# EAGLE design power1pDIN5 (EAGLE 9.3.1)
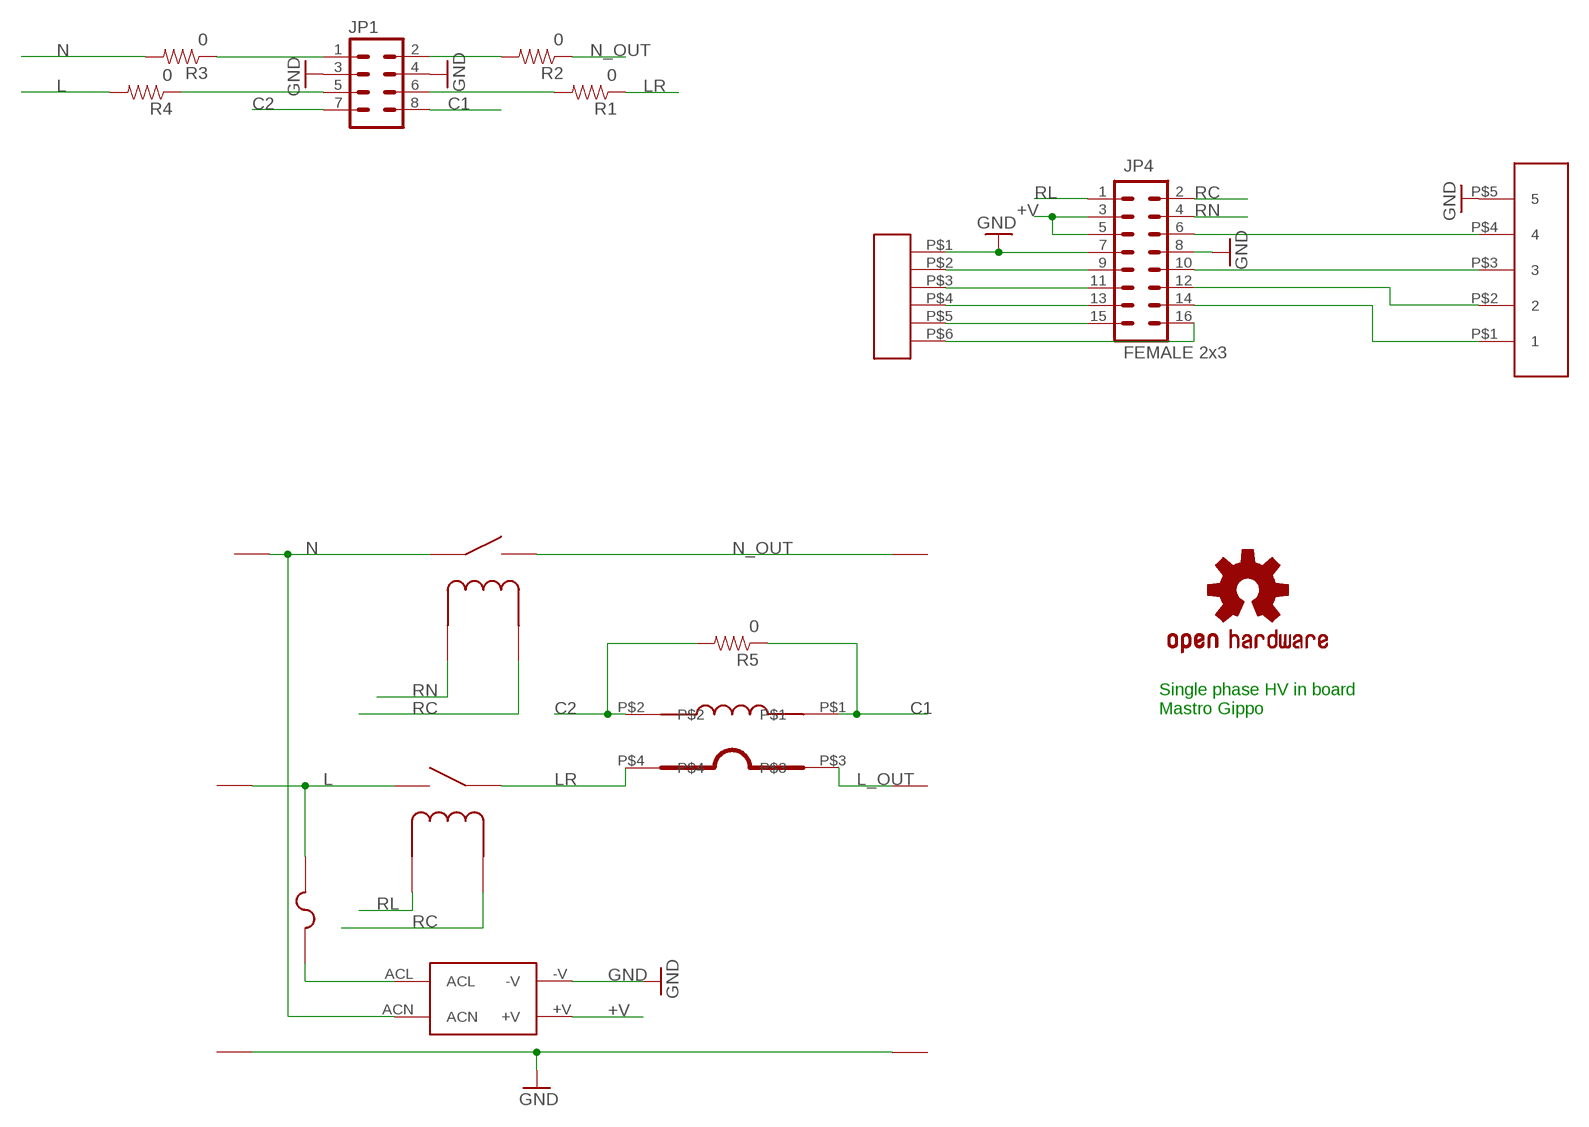
[diagram p0: schematic, sheet 1]

## Parts
JP1  M04X2  [2X4]
JP4  FEMALE 2x3  M08X2  [2X8]
R1  0  RESISTOR0805-RES  [0805]
R2  0  RESISTOR0805-RES  [0805]
R3  0  RESISTOR0805-RES  [0805]
R4  0  RESISTOR0805-RES  [0805]
R5  0  RESISTOR0805-RES  [0805]
U$1  T9S  [T9SSOLAR]
U$2  T9S  [T9SSOLAR]
U$3  PLH5_1  [PLH5]
U$4  PLH5_1  [PLH5]
U$5  PLH5_1  [PLH5]
U$6  PLH5_1  [PLH5]
U$7  FUSE-0ZRE0008FF1C  [0ZRE0008FF1C]
U$8  CSE187L  [CSE187L]
U$9  PLH5_1  [PLH5]
U$10  PLH5_1  [PLH5]
U$11  PTSA5  [PTSA5]
U$12  IRM-10-12  [ACDCMEANWELL]
U$13  OSHW-LOGOM  [OSHW-LOGO-M]
U$14  PTSA6  [PTSA6]

## Nets
+V: JP4.3 JP4.5 U$12.+V
C1: JP1.8 R5.1 U$8.P$1
C2: JP1.7 R5.2 U$8.P$2
GND: JP1.3 JP1.4 JP4.7 JP4.8 U$9.P$1 U$9.P$2 U$10.P$1 U$10.P$2 U$11.P$5 U$12.-V U$14.P$1
L: R4.2 U$2.TL1(TL) U$2.TL2(TL) U$4.P$1 U$4.P$2 U$7.P$2
L_OUT: U$6.P$1 U$6.P$2 U$8.P$3
LR: R1.1 U$2.TR1(TR) U$2.TR2(TR) U$8.P$4
N: R3.2 U$1.TR1(TR) U$1.TR2(TR) U$3.P$1 U$3.P$2 U$12.ACN
N$1: JP1.2 R2.2
N$2: JP4.15 U$14.P$5
N$3: JP4.13 U$14.P$4
N$4: JP4.11 U$14.P$3
N$5: JP1.6 R1.2
N$6: JP1.1 R3.1
N$7: JP4.9 U$14.P$2
N$8: JP4.16 U$14.P$6
N$9: JP1.5 R4.1
N$10: JP4.6 U$11.P$4
N$11: JP4.10 U$11.P$3
N$12: JP4.12 U$11.P$2
N$13: U$7.P$1 U$12.ACL
N$14: JP4.14 U$11.P$1
N_OUT: R2.1 U$1.TL1(TL) U$1.TL2(TL) U$5.P$1 U$5.P$2
RC: JP4.2 U$1.C1 U$2.C2
RL: JP4.1 U$2.C1
RN: JP4.4 U$1.C2

## Notes on the sheet
- Single phase HV in board
  Mastro Gippo

## Library data of the parts
JP1 = SparkFun-Connectors:M04X2: .1" header, two rows of four.
JP4 = SparkFun-Connectors:M08X2: .1" headers, two rows of 8 each
R1-R5 = SparkFun-Resistors:RESISTOR: Resistor Basic schematic elements and footprints for 0603, 1206, and PTH resistors.
U$1 U$2 = evse:T9S
U$3-U$6 U$9 U$10 = evse:PLH5_1
U$7 = evse:FUSE-0ZRE0008FF1C
U$8 = evse:CSE187L
U$11 = evse:PTSA5
U$12 = evse:IRM-10-12
U$13 = mastrogippo:OSHW-LOGO: Open Source Hardware Logo This logo indicates the piece of hardware it is found on incorporates a OSHW license and/or adheres to the definition of open source hardware found here: http://freedomdefined.org/OSHW
U$14 = evse:PTSA6

## Board
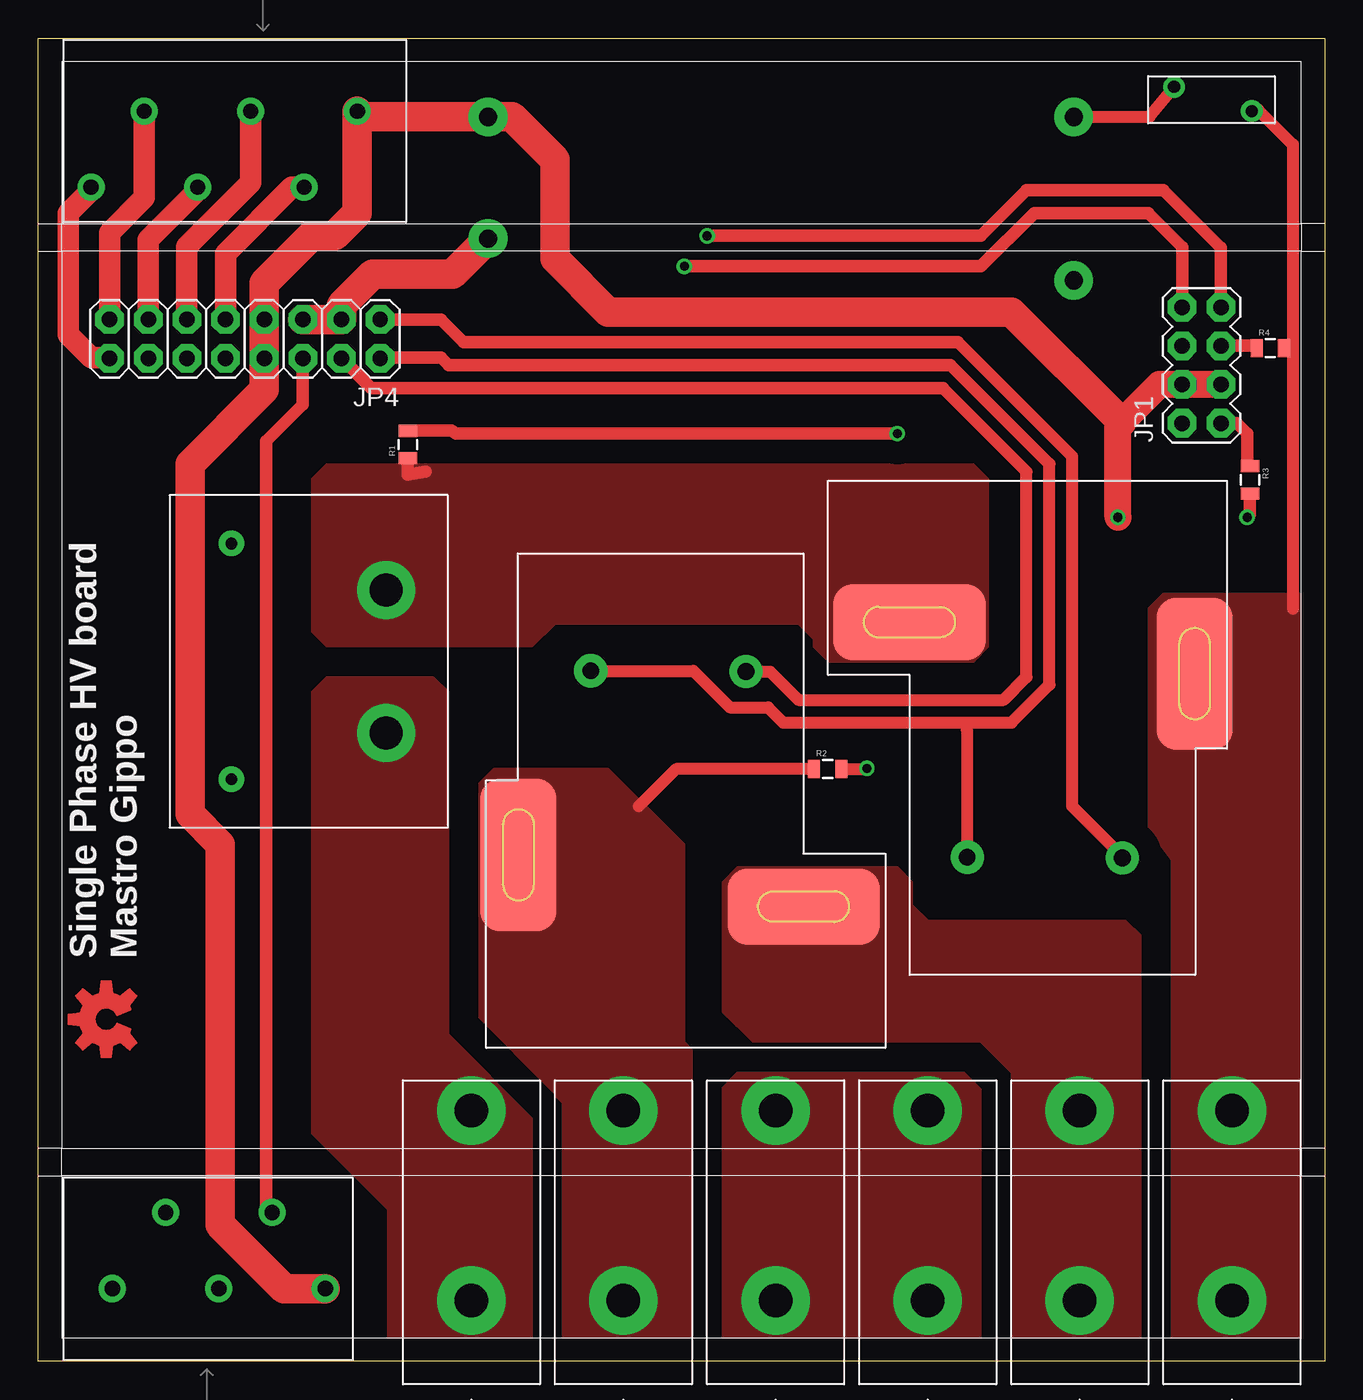
[diagram p1: board, top side]
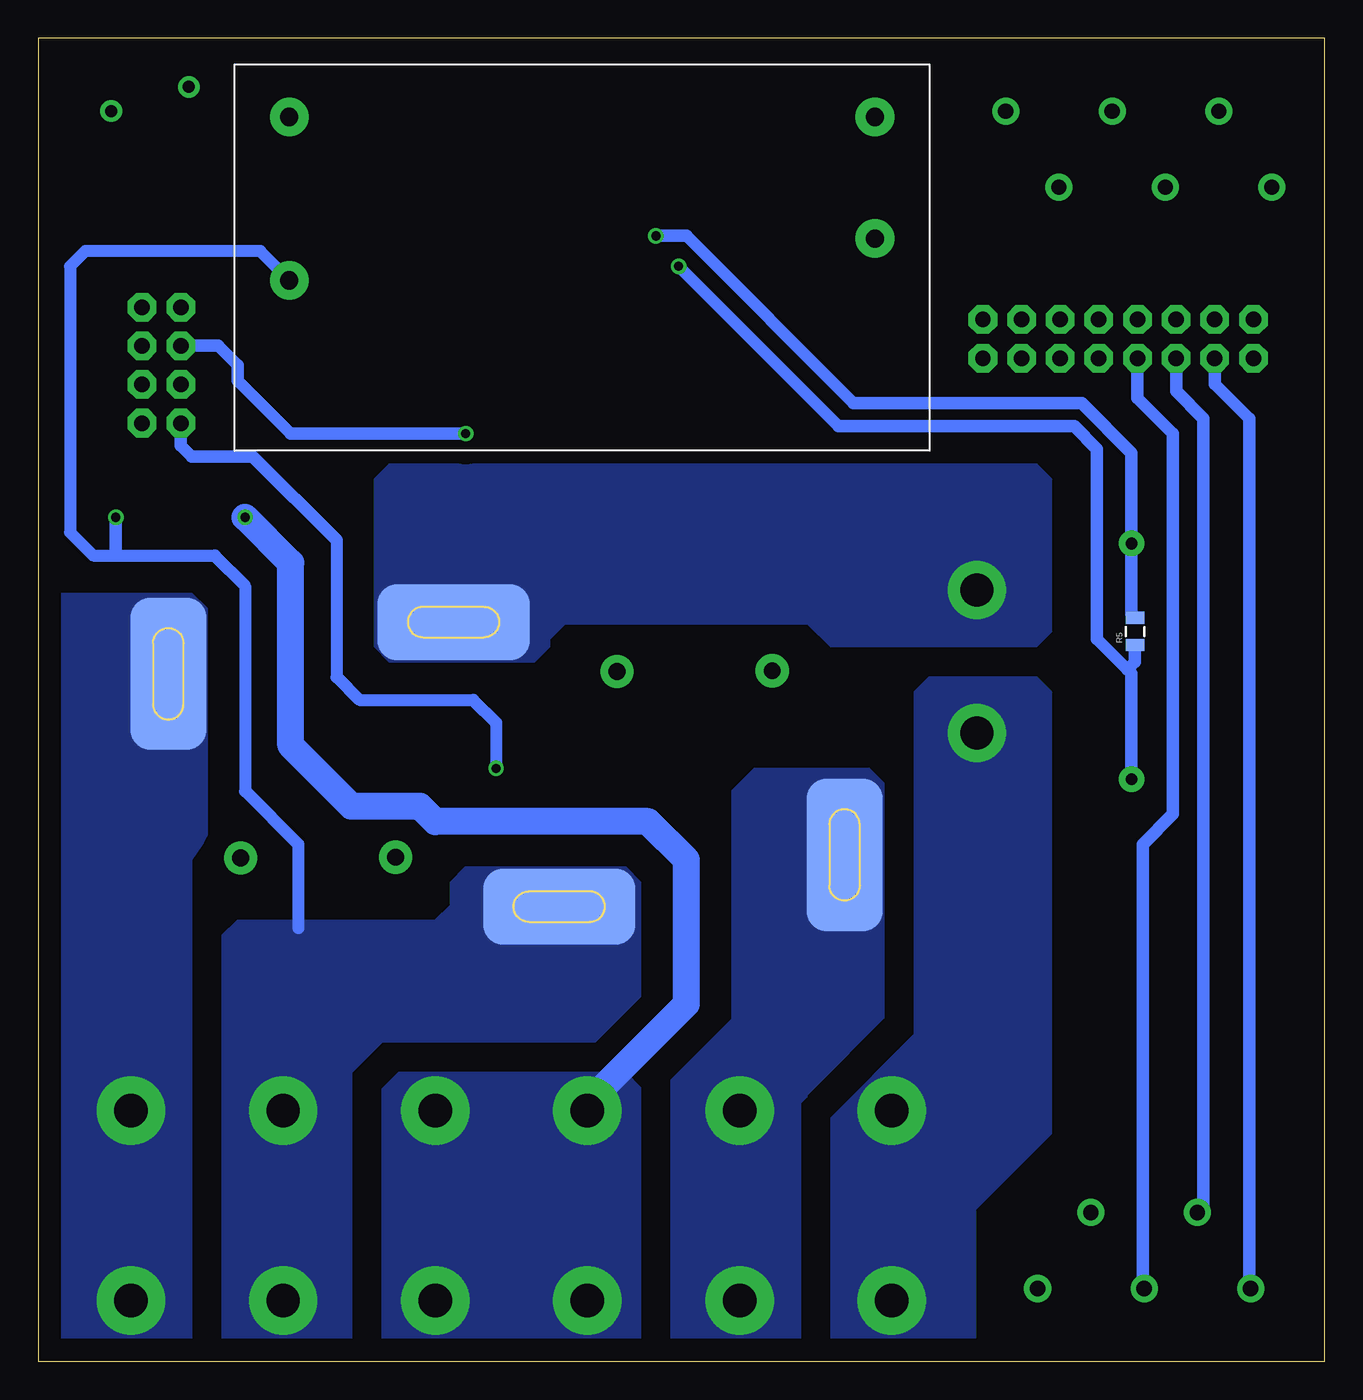
[diagram p2: board, bottom side, seen from below]

Size 84.6 x 87 mm. Coordinates in mm from the lower left corner, seen from the top.
Outline: 84.6,87 84.6,0 0,0 0,87 84.6,87
Copper layers (1*16): Top 0.035mm / dielectric 1.5mm / Bottom 0.035mm
Design rules "default": minimum track width 10mil, minimum drill 24mil, track to track 8mil, track to pad 8mil, pad to pad 8mil, via to via 8mil, smd to smd 8mil, copper to edge 40mil, drill to drill 8mil, minimum pad ring 10mil, minimum via ring 8mil, stop-mask expansion 4mil, vias tented up to drill 0mil, thermal gap 10mil

### Footprints (pad centres in the part's own frame; a part is rotated, then mirrored left to right if it is on the bottom)
2X4 = drill 1.016 pad 1.88 octagon: 1 -3.81,-1.27; 2 -3.81,1.27; 3 -1.27,-1.27; 4 -1.27,1.27; 5 1.27,-1.27; 6 1.27,1.27; 7 3.81,-1.27; 8 3.81,1.27
2X8 = drill 1.016 pad 1.88 octagon: 1 0,0; 2 0,2.54; 3 2.54,0; 4 2.54,2.54; 5 5.08,0; 6 5.08,2.54; 7 7.62,0; 8 7.62,2.54; 9 10.16,0; 10 10.16,2.54; 11 12.7,0; 12 12.7,2.54; 13 15.24,0; 14 15.24,2.54; 15 17.78,0; 16 17.78,2.54
0805 = smd 0.8 x 1.2: 1 -0.9,0; 2 0.9,0
T9SSOLAR = drill 1.1 pad 2.184: C1 -14,-15.5; C2 -3.8,-15.45 | smd 5 x 10: TL1 -18.75,-3.4 | smd 5 x 10 bottom: TL2 -18.75,-3.4 | smd 10 x 5: TR1 0,0 | smd 10 x 5 bottom: TR2 0,0
PLH5 = drill 2.2 pad 4.5: P$1 0,0; P$2 0,12.5
0ZRE0008FF1C = drill 0.8 pad 1.422: P$1 1.7,-0.7; P$2 6.8,-2.3
CSE187L = drill 0.762 pad 1.676: P$1 -7.747,5.08; P$2 7.747,5.08 | drill 2.159 pad 3.81: P$3 -4.699,-5.08; P$4 4.699,-5.08
PTSA5 = drill 1 pad 1.778: P$1 0,0; P$2 3.5,5; P$3 7,0; P$4 10.5,5; P$5 14,0
ACDCMEANWELL = drill 1.2 pad 2.54: +V 3.6,-11.5; -V 3.6,-3.5; ACL 42.1,-3.5; ACN 42.1,-14.25
PTSA6 = drill 1 pad 1.778: P$1 0,0; P$2 3.5,5; P$3 7,0; P$4 10.5,5; P$5 14,0; P$6 17.5,5

### Placement (x,y rotation side)
JP1  76.49,65.49 90 top
JP4  22.49,68.49 180 top
R1  24.31,60.28 90 top
R2  51.91,38.95 0 top
R3  79.67,57.96 270 top
R4  81.01,66.61 0 top
R5  12.49,47.99 90 bottom
U$1  50.33,29.9 180 bottom
U$2  57.29,48.61 0 bottom
U$3  68.49,3.99 0 top
U$4  78.49,3.99 0 top
U$5  38.49,3.99 0 top
U$6  28.49,3.99 0 top
U$7  72.99,84.49 0 top
U$8  17.8,46.02 90 top
U$9  48.49,3.99 0 top
U$10  58.49,3.99 0 top
U$11  4.89,4.79 0 top
U$12  25.99,85.32 0 top
U$13  4.49,22.49 90 top
U$14  20.99,82.19 180 top

### Tracks (layer width: path | path; a pad name or v marks a point on that pad's centre or on a via)
+V
  Top 1.93: JP4.5 JP4.3 19.95,69.45 21.99,71.49 27.26,71.49 U$12.+V
C1  (via drill 0.6)
  Top 0.813: v42.49,71.99 61.99,71.99 65.49,75.49 72.99,75.49 75.22,73.26 JP1.8
  Bottom 0.813: U$8.P$1 12.72,45.22 12.99,45.49 | 12.99,45.49 14.99,47.49 14.99,59.99 16.49,61.49 31.99,61.49 v42.49,71.99 | R5.1 12.49,45.99 12.99,45.49
C2  (via drill 0.6)
  Top 0.813: v43.99,73.99 61.99,73.99 64.99,76.99 73.99,76.99 77.76,73.22 JP1.7
  Bottom 0.813: v43.99,73.99 41.99,73.99 30.99,62.99 15.99,62.99 12.72,59.72 U$8.P$2 12.72,49.12 R5.2
GND  (via drill 0.6)
  Top 1.778: v70.99,55.49 70.99,61.49 71.24,61.74 73.72,64.22 JP1.4 JP1.3
  Top 1.93: 71.24,61.74 63.99,68.99 37.49,68.99 33.99,72.49 33.99,78.99 31.16,81.82 U$12.-V 21.36,81.82 U$14.P$1 20.99,75.49 19.49,73.99 17.99,73.99 14.87,70.87 JP4.7 JP4.8 14.87,63.87 9.99,58.99 9.99,35.99 11.99,33.99 11.99,8.99 16.19,4.79 U$11.P$5
  Bottom 1.778: U$9.P$2 47.99,17.49 41.99,23.49 41.99,32.99 44.49,35.49 58.49,35.49 59.49,36.49 63.99,36.49 67.99,40.49 67.99,52.49 v70.99,55.49
  pour Top (isolate 1.5, rank 6, no thermals): 44.99,2.49 44.99,1.49 44.99,0.99 45.49,0.49 45.99,-0.01 60.99,-0.01 61.99,0.99 61.99,17.99 60.99,18.99 45.99,18.99 44.99,17.99
  pour Bottom (isolate 1.5, rank 6, no thermals): 44.99,2.49 44.99,1.49 44.99,0.99 45.49,0.49 45.99,-0.01 60.99,-0.01 61.99,0.99 61.99,17.99 60.99,18.99 45.99,18.99 44.99,17.99
L
  Top 0.8: 82.49,49.49 82.49,66.49 82.49,79.99 80.19,82.29 U$7.P$2
  Top 0.813: R4.2 82.37,66.61 82.49,66.49
  pour Top (isolate 1.5, rank 4, no thermals): 74.49,0.99 75.49,-0.01 81.99,-0.01 84.49,2.49 84.49,49.49 83.49,50.49 73.99,50.49 72.99,49.49 72.99,34.99 74.49,32.99
  pour Bottom (isolate 1.5, rank 4, no thermals): 74.49,0.99 75.49,-0.01 81.99,-0.01 84.49,2.49 84.49,49.49 83.49,50.49 74.49,50.49 73.49,49.49 73.49,34.49 74.49,32.99
L_OUT
  pour Top (isolate 1.5, no thermals): 32.49,0.99 31.49,-0.01 23.99,-0.01 22.99,0.99 22.99,9.99 17.99,14.99 17.99,43.99 18.99,44.99 25.99,44.99 26.99,43.99 26.99,21.49 32.49,15.99
  pour Bottom (isolate 1.5, no thermals): 32.49,0.99 31.49,-0.01 23.99,-0.01 22.99,0.99 22.99,9.99 17.99,14.99 17.99,43.99 18.99,44.99 25.99,44.99 26.99,43.99 26.99,21.49 32.49,15.99
LR
  Top 0.813: R1.1 24.31,58.31 25.49,58.49
  pour Top (isolate 1.5, rank 5, no thermals): 50.99,47.49 50.99,46.99 51.99,45.99 61.49,45.99 62.49,46.99 62.49,57.99 61.49,58.99 18.99,58.99 17.99,57.99 17.99,47.99 18.99,46.99 32.49,46.99 33.99,48.49 49.99,48.49
  pour Bottom (isolate 1.5, rank 5, no thermals): 50.99,47.49 50.99,46.99 51.99,45.99 61.49,45.99 62.49,46.99 62.49,57.99 61.49,58.99 18.99,58.99 17.99,57.99 17.99,47.99 18.99,46.99 32.49,46.99 33.99,48.49 49.99,48.49
N  (via drill 0.6)
  Top 0.813: R3.2 79.67,55.68 v79.49,55.49
  Bottom 0.8: U$12.ACN 68.09,71.09 69.99,72.99 81.49,72.99 82.49,71.99 82.49,54.49 80.99,52.99 79.49,52.99 72.99,52.99 70.99,50.99 70.99,37.49 67.49,33.99 67.49,28.49
  Bottom 0.813: v79.49,55.49 79.49,52.99
  pour Top (isolate 1.5, rank 3, no thermals): 72.49,0.99 71.49,-0.01 64.99,-0.01 63.99,0.99 63.99,18.99 61.99,20.99 46.99,20.99 44.99,22.99 44.99,31.49 45.99,32.49 56.49,32.49 57.49,31.49 57.49,29.99 58.49,28.99 71.49,28.99 72.49,27.99
  pour Bottom (isolate 1.5, rank 3, no thermals): 72.49,0.99 71.49,-0.01 64.99,-0.01 63.99,0.99 63.99,18.99 61.99,20.99 47.99,20.99 44.99,23.99 44.99,31.49 45.99,32.49 56.49,32.49 57.49,31.49 57.49,29.99 58.49,28.99 71.49,28.99 72.49,27.99
N$1  (via drill 0.6)
  Top 0.8: R2.2 54.44,38.95 v54.49,38.99
  Bottom 0.8: 64.99,53.99 64.99,44.99 63.49,43.49 55.99,43.49 54.49,41.99 v54.49,38.99
  Bottom 0.813: JP1.2 75.22,60.22 74.49,59.49 70.49,59.49 64.99,53.99
N$2
  Top 1.422: U$14.P$5 6.99,76.49 4.71,74.21 JP4.15
N$3
  Top 1.422: U$14.P$4 10.59,77.09 7.25,73.75 JP4.13
N$4
  Top 1.422: JP4.11 9.79,73.29 13.99,77.49 U$14.P$3
N$5  (via drill 0.6)
  Top 0.813: R1.2 27.17,61.18 27.49,60.99 v56.49,60.99
  Bottom 0.813: v56.49,60.99 67.99,60.99 71.49,64.49 71.49,65.49 72.76,66.76 JP1.6
N$6
  Top 0.813: R3.1 79.49,59.17 79.49,60.99 78.8,61.68 JP1.1
N$7
  Top 1.422: U$14.P$2 16.69,77.19 12.33,72.83 JP4.9
N$8
  Top 1.422: U$14.P$6 3.59,77.09 1.99,75.49 1.99,67.49 3.49,65.99 4.67,65.99 JP4.16
N$9
  Top 0.813: JP1.5 79.95,66.76 R4.1
N$10
  Top 0.813: JP4.6 17.41,62.91 14.99,60.49 14.99,10.19 U$11.P$4
N$11
  Bottom 0.813: JP4.10 12.33,63.33 9.99,60.99 9.99,35.99 11.99,33.99 11.99,4.89 U$11.P$3
N$12
  Bottom 0.813: JP4.12 9.79,63.79 7.99,61.99 7.99,10.19 U$11.P$2
N$13
  Top 0.8: U$12.ACL 73.06,81.82 U$7.P$1
N$14
  Bottom 0.813: JP4.14 7.25,64.25 4.99,61.99 4.99,4.89 U$11.P$1
N_OUT
  Top 0.8: R2.1 41.94,38.95 39.49,36.49
  pour Top (isolate 1.5, rank 2, no thermals): 42.99,0.99 41.99,-0.01 35.49,-0.01 34.49,0.99 34.49,16.99 28.99,22.49 28.99,37.99 29.99,38.99 37.49,38.99 42.49,33.99 42.49,20.99 42.99,20.49
  pour Bottom (isolate 1.5, rank 2, no thermals): 42.99,0.99 41.99,-0.01 35.49,-0.01 34.49,0.99 34.49,16.99 28.99,22.49 28.99,37.99 29.99,38.99 37.49,38.99 38.99,37.49 38.99,22.49 42.99,18.49
RC
  Top 0.8: U$1.C1 43.08,45.4 45.49,42.99 47.99,42.99 48.99,41.99 60.99,41.99 | 60.99,41.99 63.99,41.99 66.49,44.49 66.49,58.99 59.99,65.49 | U$2.C2 61.09,41.39 60.99,41.99
  Top 0.813: 59.99,65.49 26.99,65.49 26.49,65.99 22.53,65.99 JP4.2
RL
  Top 0.8: U$2.C1 71.29,33.19 67.99,36.49 67.99,59.49 60.49,66.99
  Top 0.813: 60.49,66.99 27.99,66.99 26.49,68.49 JP4.1
RN
  Top 0.8: U$1.C2 48.13,45.35 49.99,43.49 63.49,43.49 64.99,44.99 64.99,58.49 59.49,63.99
  Top 0.813: 59.49,63.99 21.91,63.99 JP4.4

### Text on the board
tNames: Single Phase HV board / Mastro Gippo